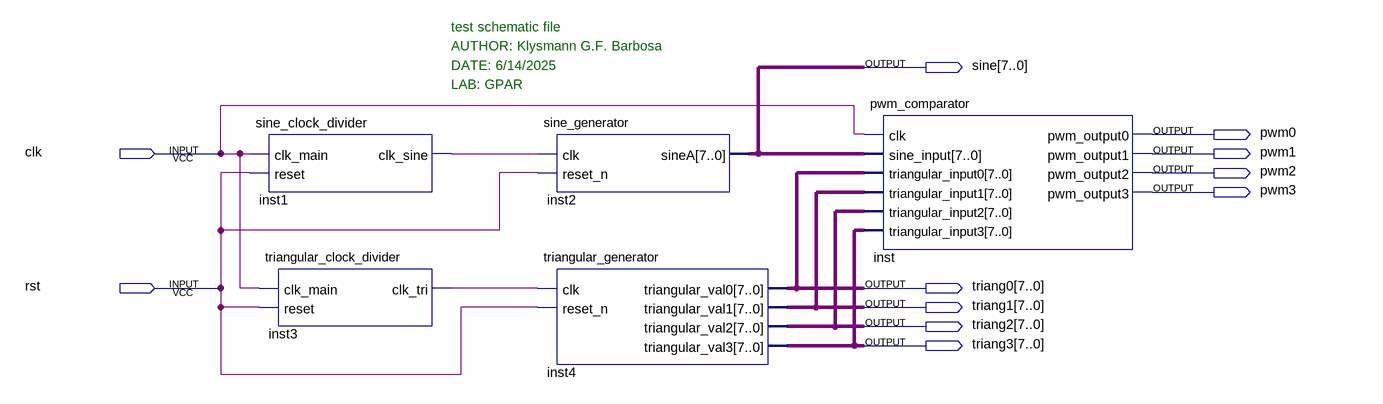
[diagram p0: schematic sheet]
// Quartus schematic test.bdf as structural Verilog: 5 symbols, 11 pins
module test (
  input  clk,
  input  rst,
  output [7:0] sine,
  output pwm0,
  output pwm1,
  output pwm2,
  output pwm3,
  output [7:0] triang0,
  output [7:0] triang1,
  output [7:0] triang2,
  output [7:0] triang3
);

  wire inst1_clk_sine, inst3_clk_tri;

  sine_clock_divider inst1 (.clk_main(clk), .reset(rst), .clk_sine(inst1_clk_sine));
  triangular_clock_divider inst3 (.clk_main(clk), .reset(rst), .clk_tri(inst3_clk_tri));
  sine_generator inst2 (.clk(inst1_clk_sine), .reset_n(rst), .sineA(sine));
  triangular_generator inst4 (
    .clk(inst3_clk_tri), .reset_n(rst), .triangular_val0(triang0), .triangular_val1(triang1),
    .triangular_val2(triang2), .triangular_val3(triang3));
  pwm_comparator inst (
    .clk(clk), .sine_input(sine), .triangular_input0(triang0), .triangular_input1(triang1),
    .triangular_input2(triang2), .triangular_input3(triang3), .pwm_output0(pwm0), .pwm_output1(pwm1),
    .pwm_output2(pwm2), .pwm_output3(pwm3));

  // Notes on the sheet:
  //   test schematic file  
  //   AUTHOR: Klysmann G.F. Barbosa  
  //   DATE: 6/14/2025   
  //   LAB: GPAR  
endmodule
